# EAGLE board hashing.board (EAGLE 6.5.0)
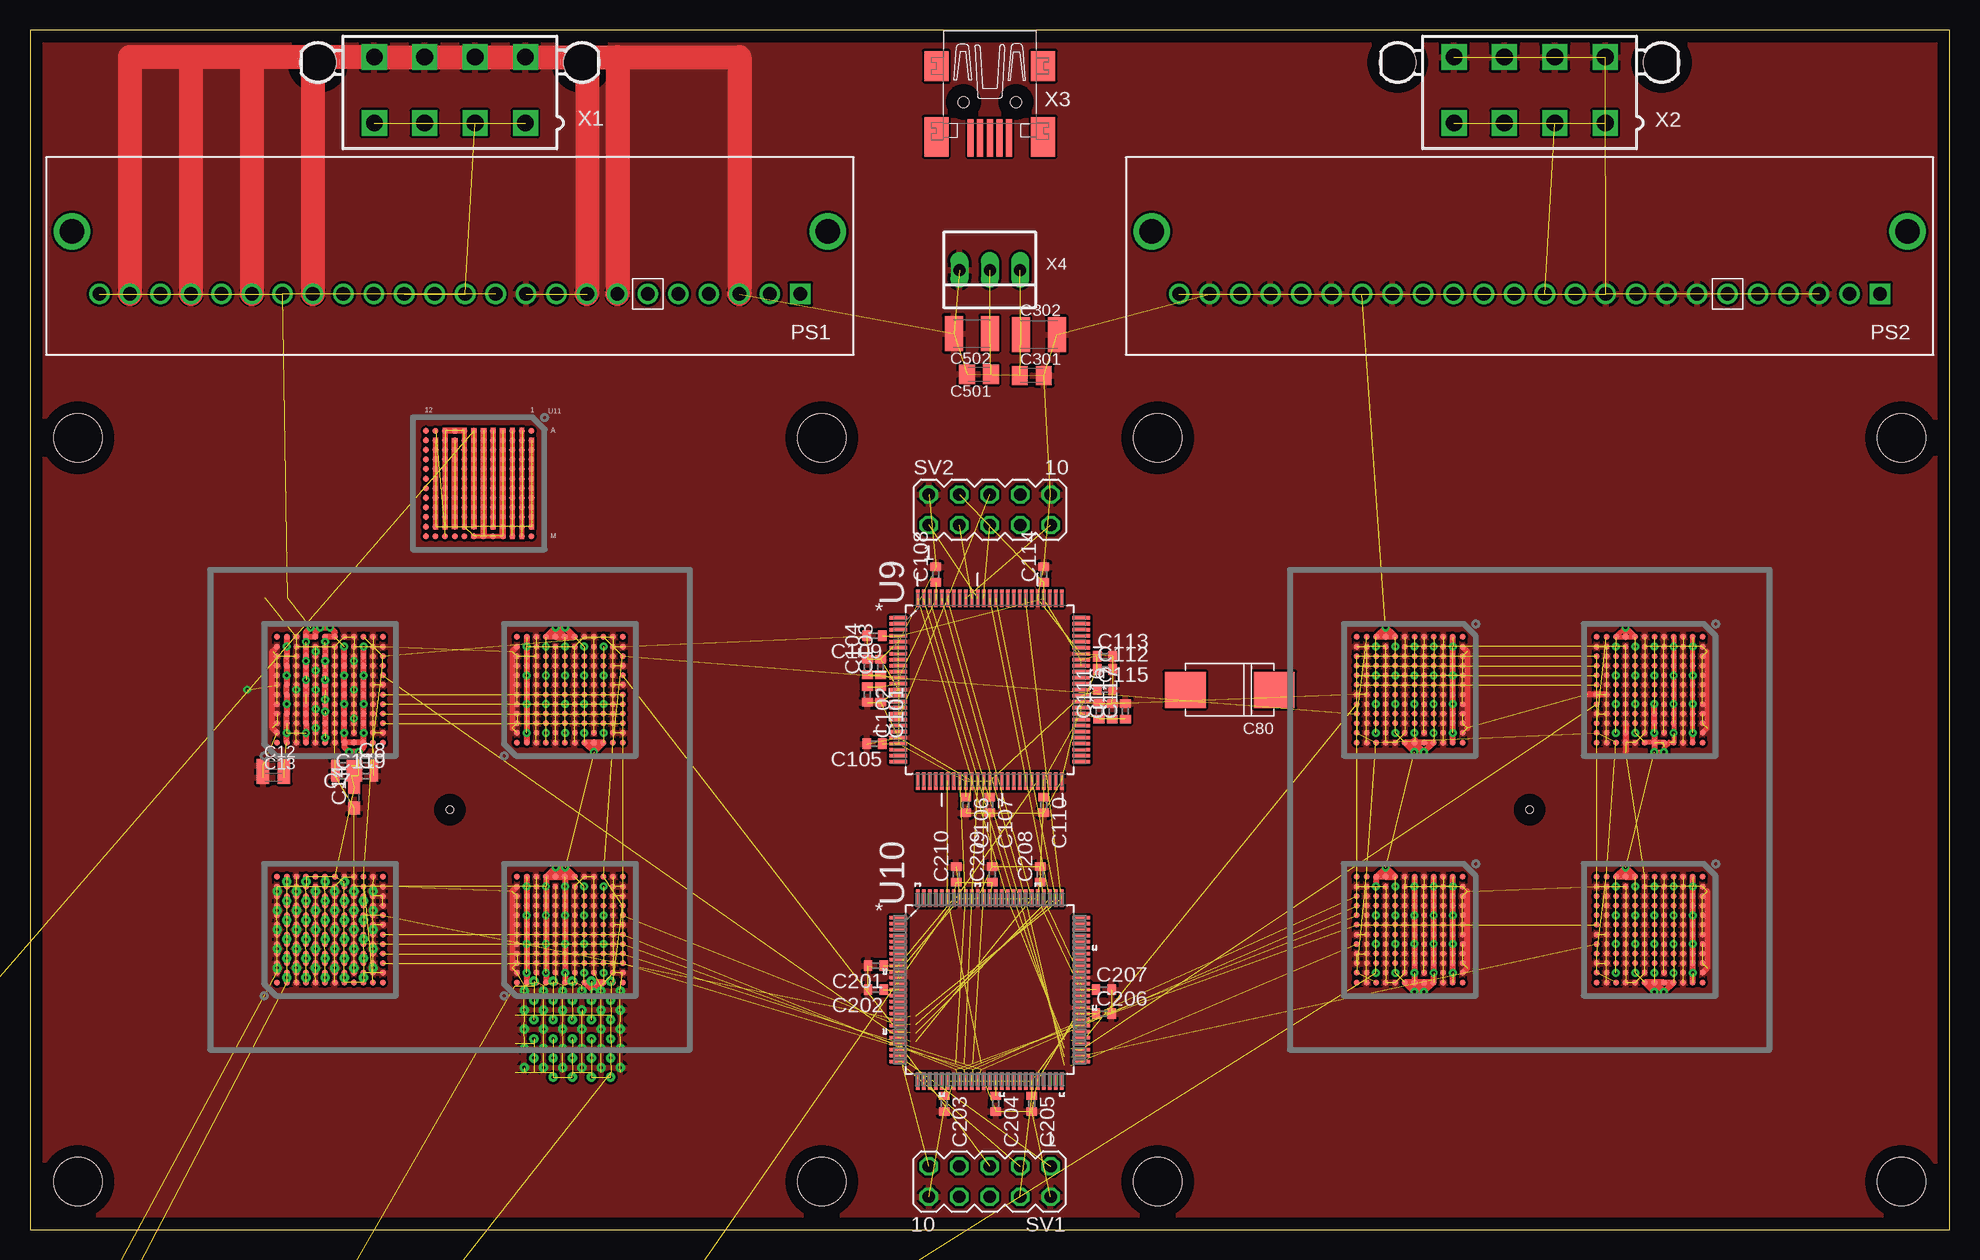
[diagram p4: board, top side]
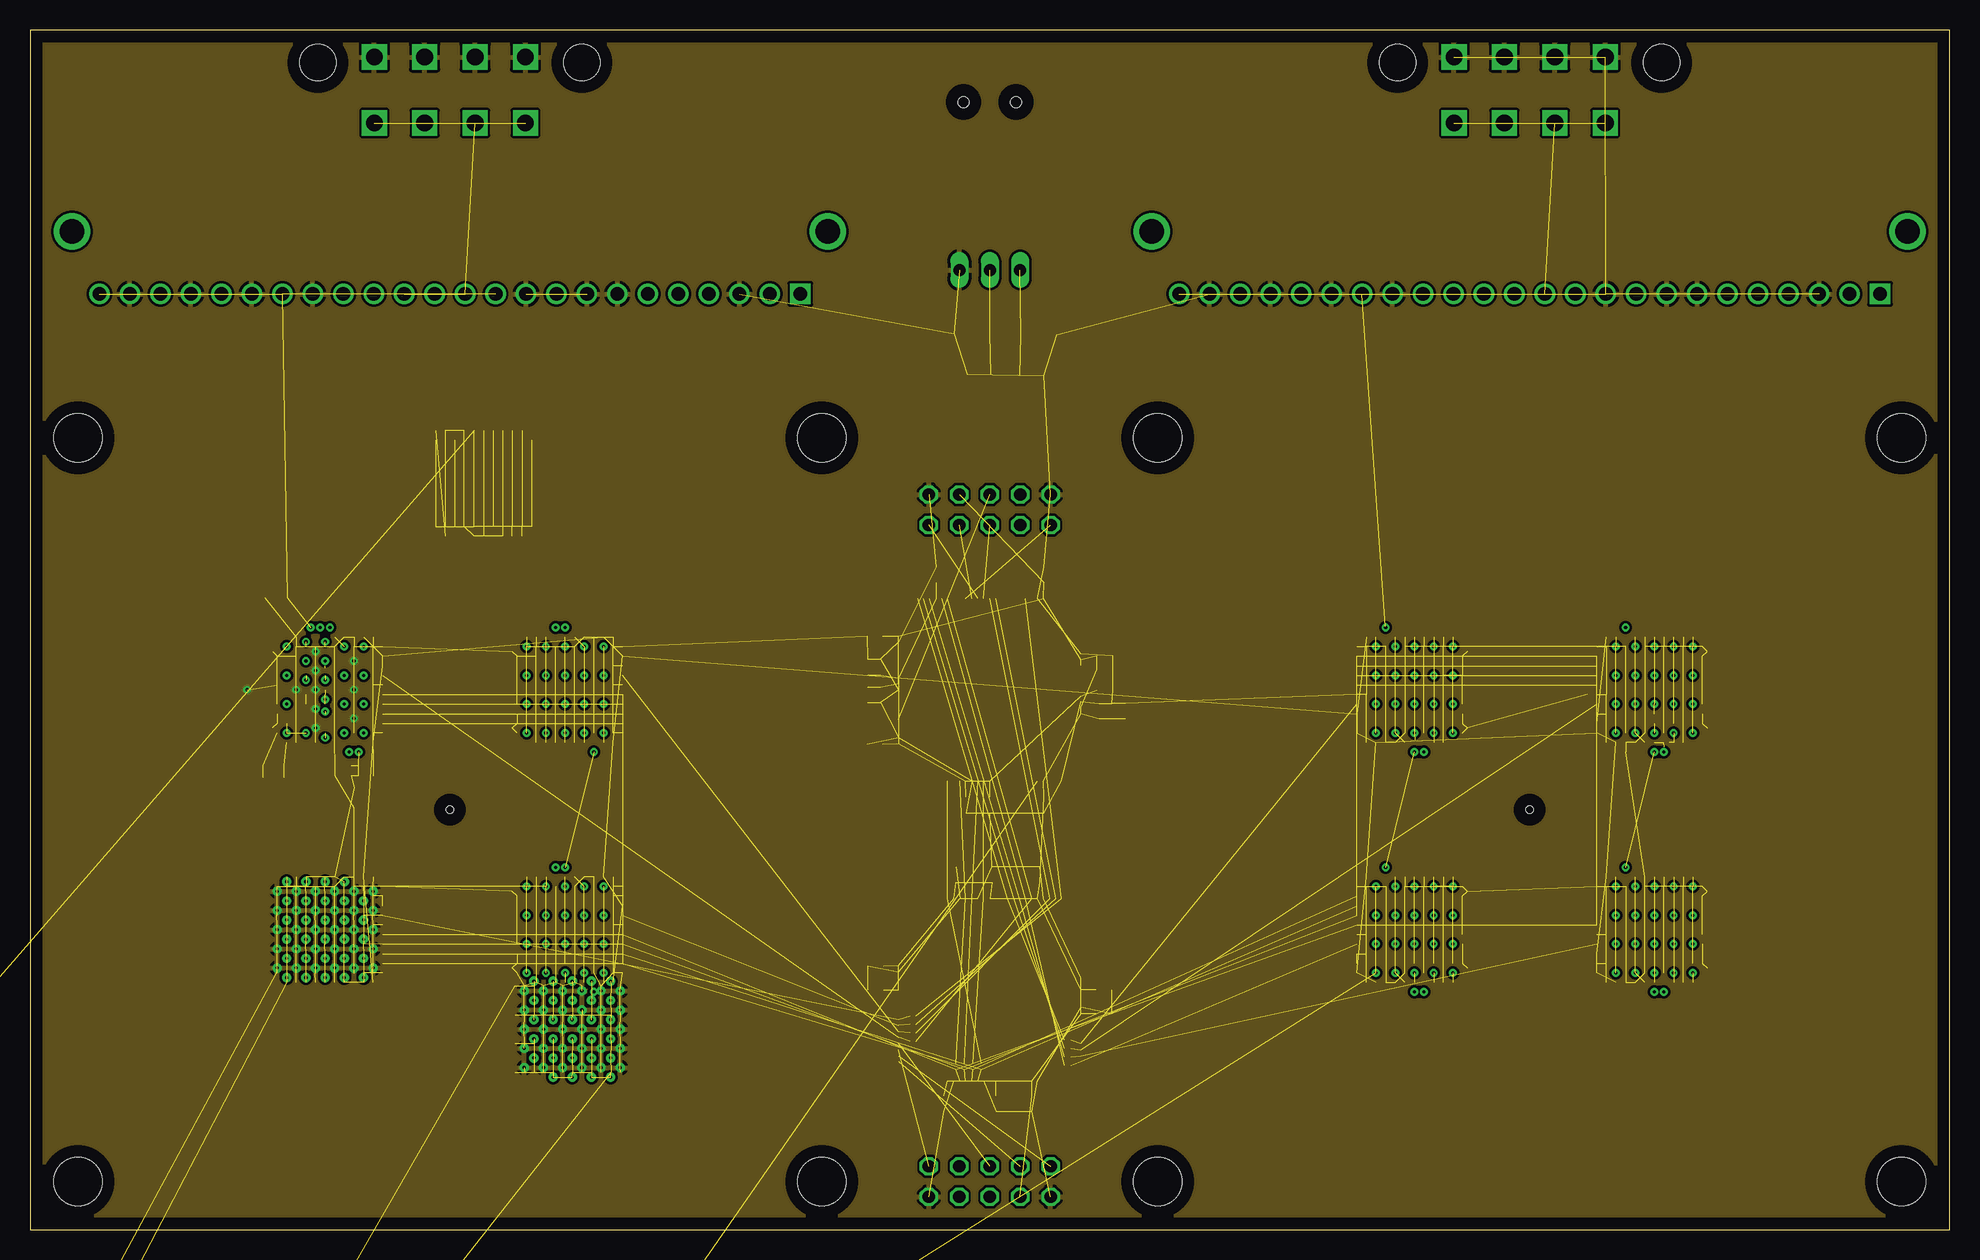
[diagram p5: board, inner layer $GND]
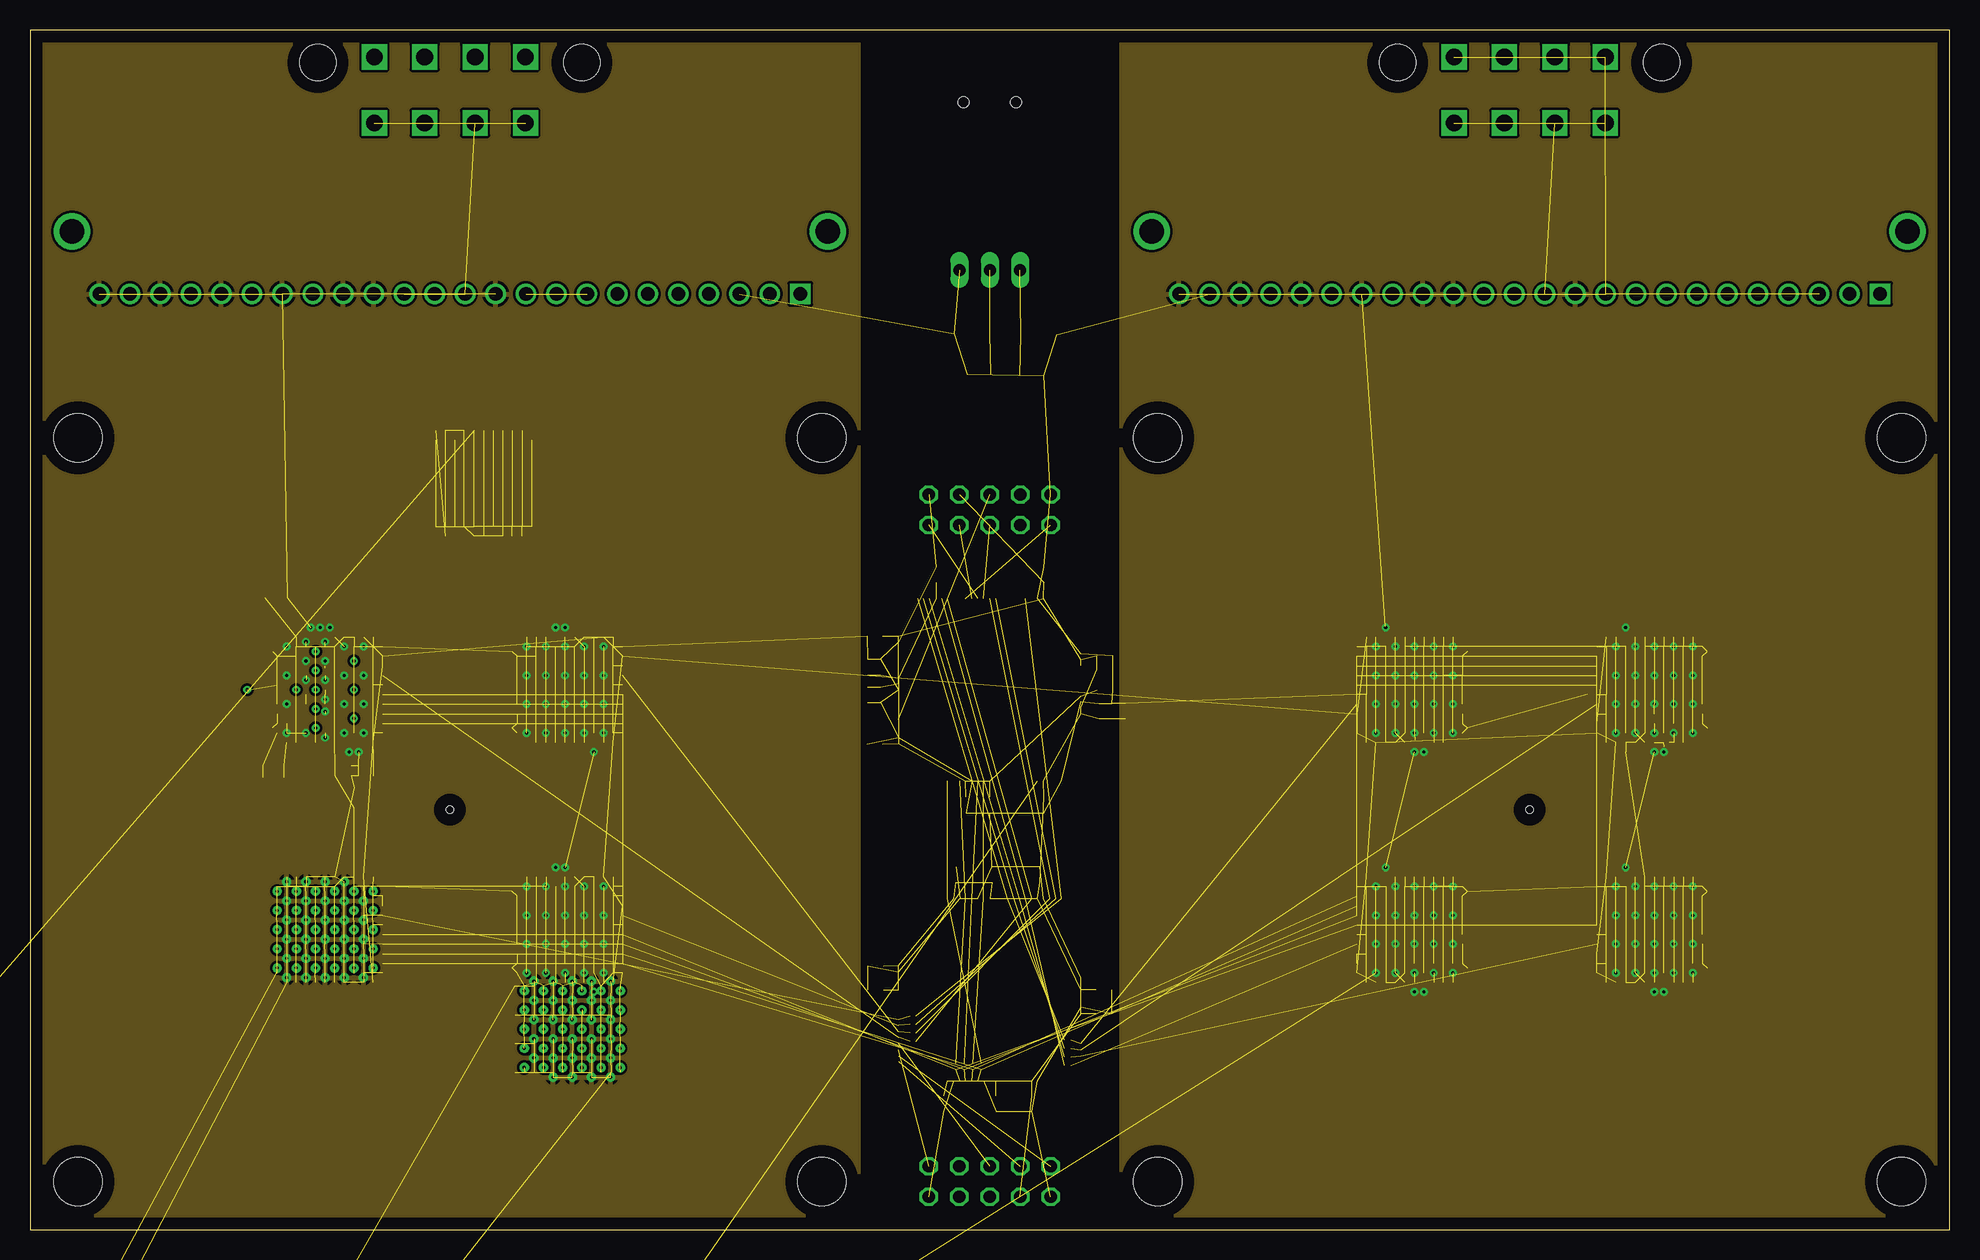
[diagram p6: board, inner layer $VCC]
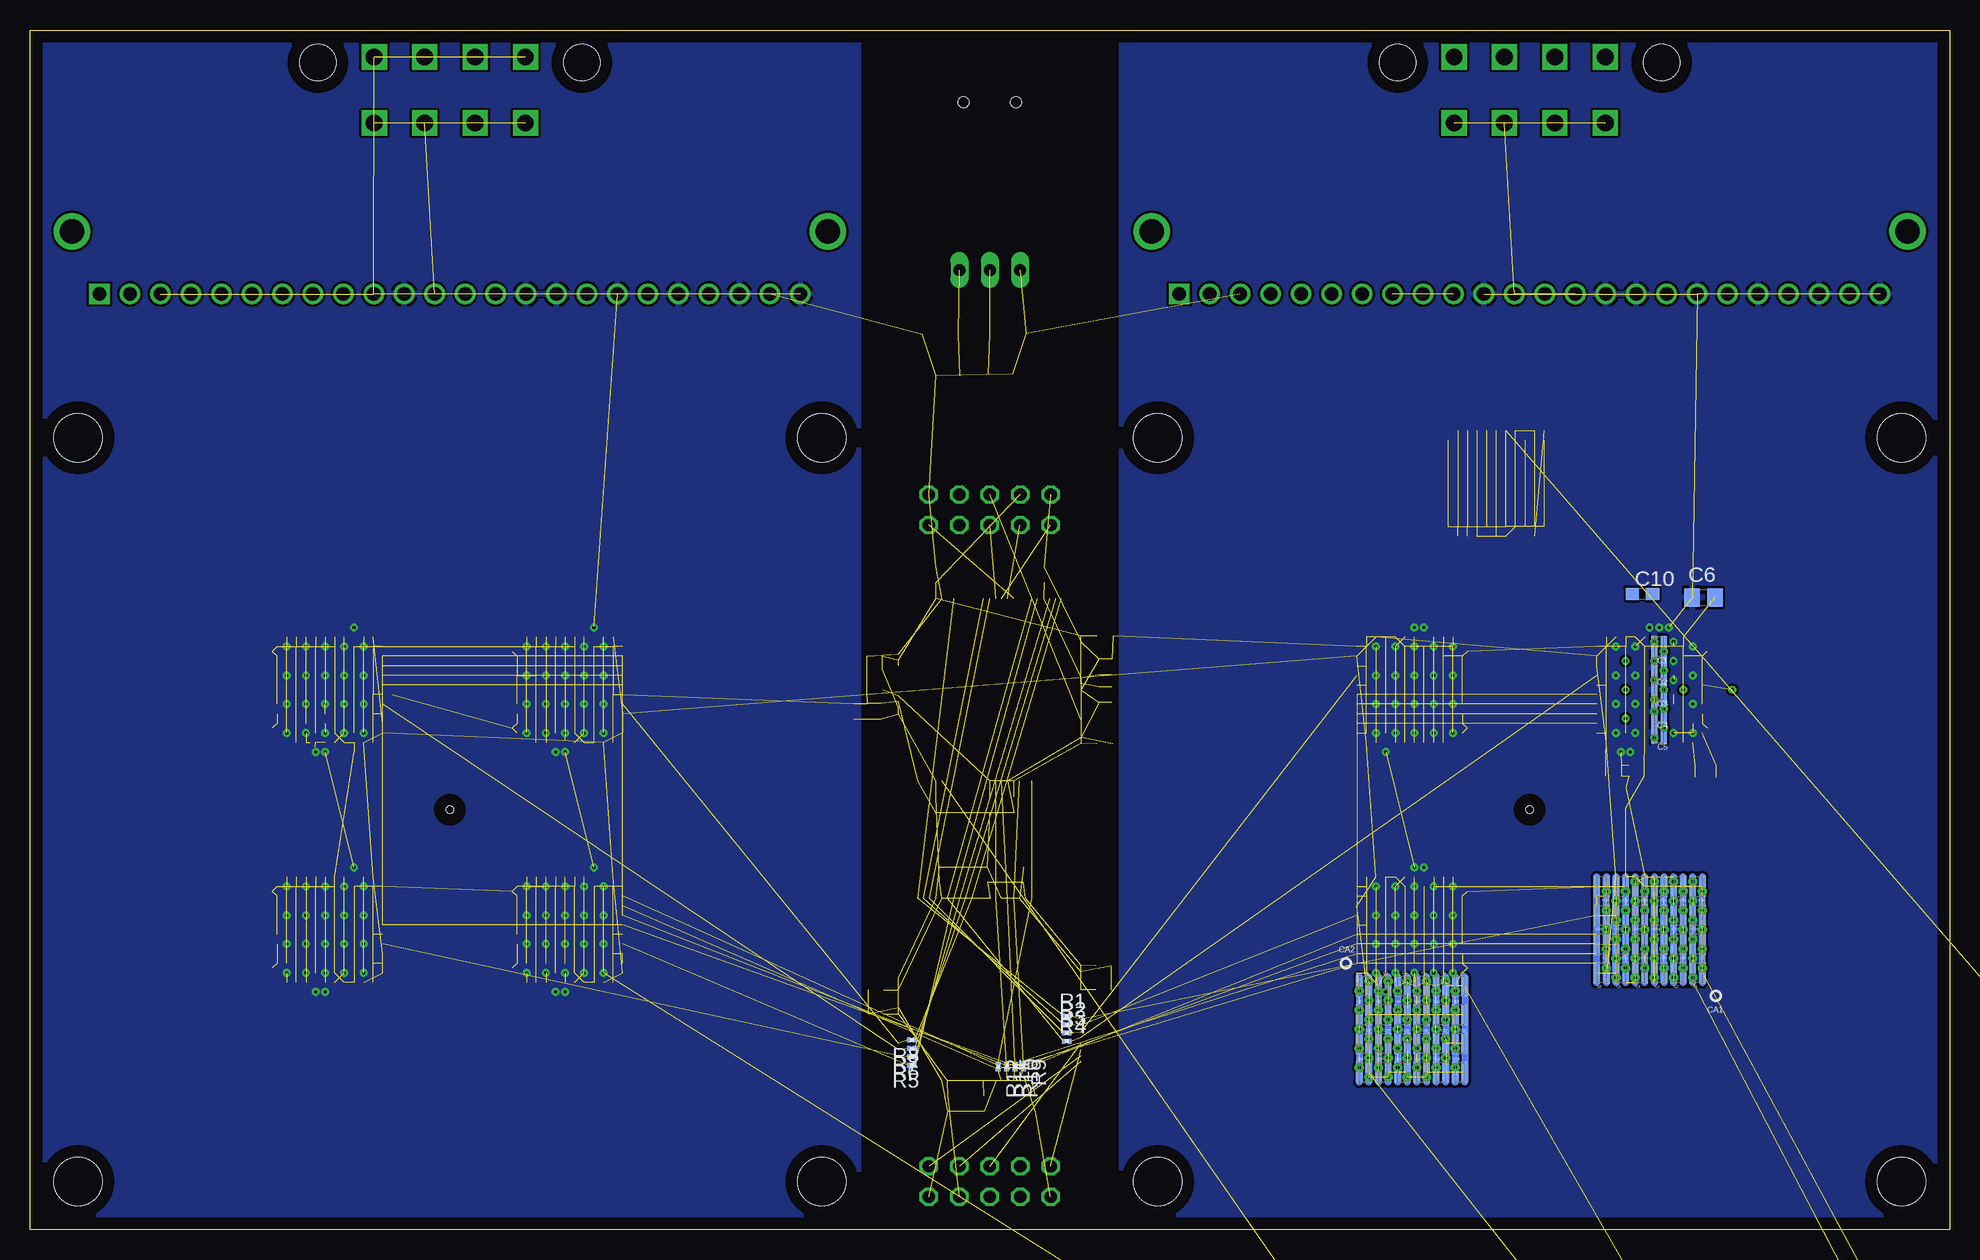
[diagram p7: board, bottom side, seen from below]

Size 160 x 100 mm. Coordinates in mm from the lower left corner, seen from the top.
Outline: 0,0 160,0 160,100 0,100 0,0
Copper layers (1*2*15*16): Top 0.075mm / dielectric 0.32mm / $GND 0.035mm / dielectric 0.32mm / $VCC 0.035mm / dielectric 0.32mm / Bottom 0.075mm
Design rules "default *": minimum track width 10mil, minimum drill 24mil, track to track 8mil, track to pad 8mil, pad to pad 8mil, via to via 8mil, smd to smd 8mil, copper to edge 40mil, drill to drill 8mil, minimum pad ring 10mil, minimum via ring 8mil, stop-mask expansion 4mil, vias tented up to drill 0mil, thermal gap 10mil
Holes 0.6 mm at 35,35 125,35
Holes 4 mm at 66,66 4,4 66,4 4,66 156,4 156,66 94,66 94,4

## Footprints (pad centres in the part's own frame; a part is rotated, then mirrored left to right if it is on the bottom)
0306-REV-GEO = smd 0.5 x 1.75: P$1 -0.4,0; P$2 0.4,0
C0805 = smd 1.3 x 1.5: 1 -0.95,0; 2 0.95,0
C0402 = smd 0.7 x 0.9: 1 -0.65,0; 2 0.65,0
C0603 = smd 1.1 x 1: 1 -0.85,0; 2 0.85,0
C0603K = smd 1.05 x 1.08: 1 -0.875,0; 2 0.875,0
2917(7343M) = smd 3.4 x 3: P$1 -3.7,0; P$2 3.7,0
C0805K = smd 1.3 x 1.6: 1 -1,0; 2 1,0
C1210K = smd 1.5 x 2.9: 1 -1.5,0; 2 1.5,0
BFL-BGA-VIA-PATTERN = drill 0.26 pad 0.6: N$2 0.4,-1.6; N$3 0.4,0; N$5 2,-1.6; N$6 2,0; N$8 -1.2,0; N$9 -1.2,-1.6; N$11 -2.8,0; N$12 -2.8,-1.6; N$14 -4.4,-1.6; N$15 -4.4,0; N$16 3.6,-1.6; N$17 3.6,0; N$19 0.4,-3.2; N$21 2,-3.2; N$23 -1.2,-3.2; N$25 -2.8,-3.2; N$27 -4.4,-3.2; N$28 3.6,-3.2; N$30 -1.2,3.2; N$31 -1.2,1.6; N$33 -2.8,3.2; N$34 -2.8,1.6; N$36 0.4,1.6; N$37 0.4,3.2; N$39 2,1.6; N$40 2,3.2; N$42 3.6,3.2; N$43 3.6,1.6; N$44 -4.4,3.2; N$45 -4.4,1.6; P$1 -0.4,-0.8; P$4 1.2,-0.8; P$7 2.8,-0.8; P$10 -2,-0.8; P$13 -3.6,-0.8; P$18 -0.4,-2.4; P$20 1.2,-2.4; P$22 2.8,-2.4; P$24 -2,-2.4; P$26 -3.6,-2.4; P$29 -0.4,2.4; P$32 -2,2.4; P$35 -3.6,2.4; P$38 1.2,2.4; P$41 2.8,2.4; P$46 -0.4,4; P$47 -0.4,-4; P$48 -2,4; P$49 1.2,-4; P$50 -3.6,4; P$51 -2,-4; P$52 1.2,4; P$53 -3.6,-4; P$54 2.8,4; P$57 -0.4,0.8; P$58 1.2,0.8; P$59 2.8,0.8; P$60 -2,0.8; P$61 -3.6,0.8 | smd 0.5 x 1.75: N$55 -4.42,1.21; N$62 -4.42,-1.19; N$64 -4.42,-3.59; N$66 -2.82,3.61; N$68 -2.82,1.21; N$70 -2.82,-1.19; N$72 -2.82,-3.59; N$74 -1.22,3.61; N$76 -1.22,1.21; N$78 -1.22,-1.19; N$80 -1.22,-3.59; N$82 0.38,3.61; N$84 0.38,1.21; N$86 0.38,-1.19; N$88 0.38,-3.59; N$90 1.98,3.61; N$92 1.98,1.21; N$94 1.98,-1.19; N$98 3.58,3.61; N$100 3.58,1.21; N$102 3.58,-1.19; N$104 1.98,-3.59; N$106 3.58,-3.59; N$110 -4.42,3.61; P$56 -3.62,1.21; P$63 -3.62,-1.19; P$65 -3.62,-3.59; P$67 -2.02,3.61; P$69 -2.02,1.21; P$71 -2.02,-1.19; P$73 -2.02,-3.59; P$75 -0.42,3.61; P$77 -0.42,1.21; P$79 -0.42,-1.19; P$81 -0.42,-3.59; P$83 1.18,3.61; P$85 1.18,1.21; P$87 1.18,-1.19; P$89 1.18,-3.59; P$91 2.78,3.61; P$93 2.78,1.21; P$95 2.78,-1.19; P$99 4.38,3.61; P$101 4.38,1.21; P$103 4.38,-1.19; P$105 2.78,-3.59; P$107 4.38,-3.59; P$111 -3.62,3.61
YV09T60 = drill 1.143 square: P$1 -29.21,0 | drill 1.143: P$2 -26.67,0; P$3 -24.13,0; P$4 -21.59,0; P$5 -19.05,0; P$6 -16.51,0; P$7 -13.97,0; P$8 -11.43,0; P$9 -8.89,0; P$10 -6.35,0; P$11 -3.81,0; P$12 -1.27,0; P$13 1.27,0; P$14 3.81,0; P$15 6.35,0; P$16 8.89,0; P$17 11.43,0; P$18 13.97,0; P$19 16.51,0; P$20 19.05,0; P$21 21.59,0; P$22 24.13,0; P$23 26.67,0; P$24 29.21,0 | drill 2.032: P$25 -31.496,-5.207; P$26 31.496,-5.207
R0201 = smd 0.28 x 0.43: 1 -0.255,0; 2 0.255,0
MA05-2 = drill 1.016 octagon: 1 -5.08,-1.27; 2 -5.08,1.27; 3 -2.54,-1.27; 4 -2.54,1.27; 5 0,-1.27; 6 0,1.27; 7 2.54,-1.27; 8 2.54,1.27; 9 5.08,-1.27; 10 5.08,1.27
BGA-144-0.8MM = smd 0.5 x 0.5: A1 4.4,4.4; A2 3.6,4.4; A3 2.8,4.4; A4 2,4.4; A5 1.2,4.4; A6 0.4,4.4; A7 -0.4,4.4; A8 -1.2,4.4; A9 -2,4.4; A10 -2.8,4.4; A11 -3.6,4.4; A12 -4.4,4.4; B1 4.4,3.6; B2 3.6,3.6; B3 2.8,3.6; B4 2,3.6; B5 1.2,3.6; B6 0.4,3.6; B7 -0.4,3.6; B8 -1.2,3.6; B9 -2,3.6; B10 -2.8,3.6; B11 -3.6,3.6; B12 -4.4,3.6; C1 4.4,2.8; C2 3.6,2.8; C3 2.8,2.8; C4 2,2.8; C5 1.2,2.8; C6 0.4,2.8; C7 -0.4,2.8; C8 -1.2,2.8; C9 -2,2.8; C10 -2.8,2.8; C11 -3.6,2.8; C12 -4.4,2.8; D1 4.4,2; D2 3.6,2; D3 2.8,2; D4 2,2; D5 1.2,2; D6 0.4,2; D7 -0.4,2; D8 -1.2,2; D9 -2,2; D10 -2.8,2; D11 -3.6,2; D12 -4.4,2; E1 4.4,1.2; E2 3.6,1.2; E3 2.8,1.2; E4 2,1.2; E5 1.2,1.2; E6 0.4,1.2; E7 -0.4,1.2; E8 -1.2,1.2; E9 -2,1.2; E10 -2.8,1.2; E11 -3.6,1.2; E12 -4.4,1.2; F1 4.4,0.4; F2 3.6,0.4; F3 2.8,0.4; F4 2,0.4; F5 1.2,0.4; F6 0.4,0.4; F7 -0.4,0.4; F8 -1.2,0.4; F9 -2,0.4; F10 -2.8,0.4; F11 -3.6,0.4; F12 -4.4,0.4; G1 4.4,-0.4; G2 3.6,-0.4; G3 2.8,-0.4; G4 2,-0.4; G5 1.2,-0.4; G6 0.4,-0.4; G7 -0.4,-0.4; G8 -1.2,-0.4; G9 -2,-0.4; G10 -2.8,-0.4; G11 -3.6,-0.4; G12 -4.4,-0.4; H1 4.4,-1.2; H2 3.6,-1.2; H3 2.8,-1.2; H4 2,-1.2; H5 1.2,-1.2; H6 0.4,-1.2; H7 -0.4,-1.2; H8 -1.2,-1.2; H9 -2,-1.2; H10 -2.8,-1.2; H11 -3.6,-1.2; H12 -4.4,-1.2; J1 4.4,-2; J2 3.6,-2; J3 2.8,-2; J4 2,-2; J5 1.2,-2; J6 0.4,-2; J7 -0.4,-2; J8 -1.2,-2; J9 -2,-2; J10 -2.8,-2; J11 -3.6,-2; J12 -4.4,-2; K1 4.4,-2.8; K2 3.6,-2.8; K3 2.8,-2.8; K4 2,-2.8; K5 1.2,-2.8; K6 0.4,-2.8; K7 -0.4,-2.8; K8 -1.2,-2.8; K9 -2,-2.8; K10 -2.8,-2.8; K11 -3.6,-2.8; K12 -4.4,-2.8; L1 4.4,-3.6; L2 3.6,-3.6; L3 2.8,-3.6; L4 2,-3.6; L5 1.2,-3.6; L6 0.4,-3.6; L7 -0.4,-3.6; L8 -1.2,-3.6; L9 -2,-3.6; L10 -2.8,-3.6; L11 -3.6,-3.6; L12 -4.4,-3.6; M1 4.4,-4.4; M2 3.6,-4.4; M3 2.8,-4.4; M4 2,-4.4; M5 1.2,-4.4; M6 0.4,-4.4; M7 -0.4,-4.4; M8 -1.2,-4.4; M9 -2,-4.4; M10 -2.8,-4.4; M11 -3.6,-4.4; M12 -4.4,-4.4
QFP50P1600X1600X120-100N = smd 1.473 x 0.279: 1 -7.62,5.994; 2 -7.62,5.512; 3 -7.62,5.004; 4 -7.62,4.496; 5 -7.62,3.988; 6 -7.62,3.505; 7 -7.62,2.997; 8 -7.62,2.489; 9 -7.62,2.007; 10 -7.62,1.499; 11 -7.62,0.991; 12 -7.62,0.508; 13 -7.62,0; 14 -7.62,-0.508; 15 -7.62,-0.991; 16 -7.62,-1.499; 17 -7.62,-2.007; 18 -7.62,-2.489; 19 -7.62,-2.997; 20 -7.62,-3.505; 21 -7.62,-3.988; 22 -7.62,-4.496; 23 -7.62,-5.004; 24 -7.62,-5.512; 25 -7.62,-5.994; 51 7.62,-5.994; 52 7.62,-5.512; 53 7.62,-5.004; 54 7.62,-4.496; 55 7.62,-3.988; 56 7.62,-3.505; 57 7.62,-2.997; 58 7.62,-2.489; 59 7.62,-2.007; 60 7.62,-1.499; 61 7.62,-0.991; 62 7.62,-0.508; 63 7.62,0; 64 7.62,0.508; 65 7.62,0.991; 66 7.62,1.499; 67 7.62,2.007; 68 7.62,2.489; 69 7.62,2.997; 70 7.62,3.505; 71 7.62,3.988; 72 7.62,4.496; 73 7.62,5.004; 74 7.62,5.512; 75 7.62,5.994 | smd 0.279 x 1.473: 26 -5.994,-7.62; 27 -5.512,-7.62; 28 -5.004,-7.62; 29 -4.496,-7.62; 30 -3.988,-7.62; 31 -3.505,-7.62; 32 -2.997,-7.62; 33 -2.489,-7.62; 34 -2.007,-7.62; 35 -1.499,-7.62; 36 -0.991,-7.62; 37 -0.508,-7.62; 38 0,-7.62; 39 0.508,-7.62; 40 0.991,-7.62; 41 1.499,-7.62; 42 2.007,-7.62; 43 2.489,-7.62; 44 2.997,-7.62; 45 3.505,-7.62; 46 3.988,-7.62; 47 4.496,-7.62; 48 5.004,-7.62; 49 5.512,-7.62; 50 5.994,-7.62; 76 5.994,7.62; 77 5.512,7.62; 78 5.004,7.62; 79 4.496,7.62; 80 3.988,7.62; 81 3.505,7.62; 82 2.997,7.62; 83 2.489,7.62; 84 2.007,7.62; 85 1.499,7.62; 86 0.991,7.62; 87 0.508,7.62; 88 0,7.62; 89 -0.508,7.62; 90 -0.991,7.62; 91 -1.499,7.62; 92 -2.007,7.62; 93 -2.489,7.62; 94 -2.997,7.62; 95 -3.505,7.62; 96 -3.988,7.62; 97 -4.496,7.62; 98 -5.004,7.62; 99 -5.512,7.62; 100 -5.994,7.62
BFL-BGA-BIG-PADS = smd 0.5 x 0.5: A1 4.4,4.4; A2 3.6,4.4; A3 2.8,4.4; A4 2,4.4; A5 1.2,4.4; A6 0.4,4.4; A7 -0.4,4.4; A8 -1.2,4.4; A9 -2,4.4; A10 -2.8,4.4; A11 -3.6,4.4; A12 -4.4,4.4; B1 4.4,3.6; B2 3.6,3.6; B3 2.8,3.6; B4 2,3.6; B5 1.2,3.6; B6 0.4,3.6; B7 -0.4,3.6; B8 -1.2,3.6; B9 -2,3.6; B10 -2.8,3.6; B11 -3.6,3.6; B12 -4.4,3.6; C1 4.4,2.8; C2 3.6,2.8; C3 2.8,2.8; C4 2,2.8; C5 1.2,2.8; C6 0.4,2.8; C7 -0.4,2.8; C8 -1.2,2.8; C9 -2,2.8; C10 -2.8,2.8; C11 -3.6,2.8; C12 -4.4,2.8; D1 4.4,2; D2 3.6,2; D3 2.8,2; D4 2,2; D5 1.2,2; D6 0.4,2; D7 -0.4,2; D8 -1.2,2; D9 -2,2; D10 -2.8,2; D11 -3.6,2; D12 -4.4,2; E1 4.4,1.2; E2 3.6,1.2; E3 2.8,1.2; E4 2,1.2; E5 1.2,1.2; E6 0.4,1.2; E7 -0.4,1.2; E8 -1.2,1.2; E9 -2,1.2; E10 -2.8,1.2; E11 -3.6,1.2; E12 -4.4,1.2; F1 4.4,0.4; F2 3.6,0.4; F3 2.8,0.4; F4 2,0.4; F5 1.2,0.4; F6 0.4,0.4; F7 -0.4,0.4; F8 -1.2,0.4; F9 -2,0.4; F10 -2.8,0.4; F11 -3.6,0.4; F12 -4.4,0.4; G1 4.4,-0.4; G2 3.6,-0.4; G3 2.8,-0.4; G4 2,-0.4; G5 1.2,-0.4; G6 0.4,-0.4; G7 -0.4,-0.4; G8 -1.2,-0.4; G9 -2,-0.4; G10 -2.8,-0.4; G11 -3.6,-0.4; G12 -4.4,-0.4; H1 4.4,-1.2; H2 3.6,-1.2; H3 2.8,-1.2; H4 2,-1.2; H5 1.2,-1.2; H6 0.4,-1.2; H7 -0.4,-1.2; H8 -1.2,-1.2; H9 -2,-1.2; H10 -2.8,-1.2; H11 -3.6,-1.2; H12 -4.4,-1.2; J1 4.4,-2; J2 3.6,-2; J3 2.8,-2; J4 2,-2; J5 1.2,-2; J6 0.4,-2; J7 -0.4,-2; J8 -1.2,-2; J9 -2,-2; J10 -2.8,-2; J11 -3.6,-2; J12 -4.4,-2; K1 4.4,-2.8; K2 3.6,-2.8; K3 2.8,-2.8; K4 2,-2.8; K5 1.2,-2.8; K6 0.4,-2.8; K7 -0.4,-2.8; K8 -1.2,-2.8; K9 -2,-2.8; K10 -2.8,-2.8; K11 -3.6,-2.8; K12 -4.4,-2.8; L1 4.4,-3.6; L2 3.6,-3.6; L3 2.8,-3.6; L4 2,-3.6; L5 1.2,-3.6; L6 0.4,-3.6; L7 -0.4,-3.6; L8 -1.2,-3.6; L9 -2,-3.6; L10 -2.8,-3.6; L11 -3.6,-3.6; L12 -4.4,-3.6; M1 4.4,-4.4; M2 3.6,-4.4; M3 2.8,-4.4; M4 2,-4.4; M5 1.2,-4.4; M6 0.4,-4.4; M7 -0.4,-4.4; M8 -1.2,-4.4; M9 -2,-4.4; M10 -2.8,-4.4; M11 -3.6,-4.4; M12 -4.4,-4.4
R0402 = smd 0.7 x 0.9: 1 -0.65,0; 2 0.65,0
5566-8 = drill 1.4 square: 1 6.3,-2.75; 2 2.1,-2.75; 3 -2.1,-2.75; 4 -6.3,-2.75; 5 6.3,2.75; 6 2.1,2.75; 7 -2.1,2.75; 8 -6.3,2.75 | hole 3: 11,2.29; -11,2.29
32005-301 = smd 3.1 x 0.5: 1 3,1.6; 2 3,0.8; 3 3,0; 4 3,-0.8; 5 3,-1.6 | smd 2.5 x 2: M1 -3,-4.45; M2 -3,4.45 | smd 3.3 x 2: M3 2.9,4.45; M4 2.9,-4.45 | hole 0.9: 0,2.2; 0,-2.2
22-23-2031 = drill 1 long: 1 -2.54,0; 2 0,0; 3 2.54,0

## Placement (x,y rotation side)
C1  [0306-REV-GEO]  24.2,48.6 180 bottom
C2  [0306-REV-GEO]  24.2,46.8 180 bottom
C3  [0306-REV-GEO]  24.2,45 180 bottom
C4  [0306-REV-GEO]  24.2,43.2 180 bottom
C5  [0306-REV-GEO]  24.2,41.4 180 bottom
C6  [C0805]  20.5,52.7 0 bottom
C7  [C0402]  26.1,38.7 180 top
C8  [C0402]  28,38.7 0 top
C9  [C0402]  28,37.8 0 top
C10  [C0603]  25.6,53 0 bottom
C11  [C0402]  26.1,37.8 0 top
C12  [C0603K]  20.3,38.7 0 top
C13  [C0603K]  20.3,37.7 0 top
C14  [C0603]  27,36 90 top
C15  [C0603K]  5.4,-8.3 0 top  (outside the outline)
C16  [C0603K]  1.6,-11.4 0 top  (outside the outline)
C17  [C0603K]  5.4,-11.4 0 top  (outside the outline)
C18  [C0603K]  1.6,-14.5 0 top  (outside the outline)
C19  [C0603K]  5.4,-14.5 0 top  (outside the outline)
C21  [C0603K]  1.6,-20.7 0 top  (outside the outline)
C22  [C0603K]  5.4,-20.7 0 top  (outside the outline)
C23  [C0603K]  1.6,-23.8 0 top  (outside the outline)
C24  [C0603K]  5.4,-23.8 0 top  (outside the outline)
C25  [C0603K]  1.6,-26.9 0 top  (outside the outline)
C26  [C0603K]  5.4,-26.9 0 top  (outside the outline)
C27  [C0603K]  1.6,-30 0 top  (outside the outline)
C28  [C0603K]  5.4,-30 0 top  (outside the outline)
C29  [C0603K]  1.6,-33.1 0 top  (outside the outline)
C31  [C0603K]  1.6,-36.2 0 top  (outside the outline)
C32  [C0603K]  5.4,-36.2 0 top  (outside the outline)
C33  [C0603K]  1.6,-39.3 0 top  (outside the outline)
C34  [C0603K]  5.4,-39.3 0 top  (outside the outline)
C35  [C0603K]  1.6,-42.4 0 top  (outside the outline)
C36  [C0603K]  5.4,-42.4 0 top  (outside the outline)
C37  [C0603K]  1.6,-45.5 0 top  (outside the outline)
C38  [C0603K]  5.4,-45.5 0 top  (outside the outline)
C39  [C0603K]  1.6,-48.6 0 top  (outside the outline)
C41  [C0603K]  1.6,-51.7 0 top  (outside the outline)
C42  [C0603K]  5.4,-51.7 0 top  (outside the outline)
C43  [C0603K]  9.2,-51.7 0 top  (outside the outline)
C44  [C0603K]  13,-51.7 0 top  (outside the outline)
C45  [C0603K]  16.8,-51.7 0 top  (outside the outline)
C46  [C0603K]  1.6,-54.8 0 top  (outside the outline)
C47  [C0603K]  5.4,-54.8 0 top  (outside the outline)
C48  [C0603K]  9.2,-54.8 0 top  (outside the outline)
C49  [C0603K]  13,-54.8 0 top  (outside the outline)
C51  [C0603K]  1.6,-57.9 0 top  (outside the outline)
C52  [C0603K]  5.4,-57.9 0 top  (outside the outline)
C53  [C0603K]  9.2,-57.9 0 top  (outside the outline)
C54  [C0603K]  13,-57.9 0 top  (outside the outline)
C55  [C0603K]  16.8,-57.9 0 top  (outside the outline)
C56  [C0603K]  1.6,-61 0 top  (outside the outline)
C57  [C0603K]  5.4,-61 0 top  (outside the outline)
C58  [C0603K]  9.2,-61 0 top  (outside the outline)
C59  [C0603K]  13,-61 0 top  (outside the outline)
C61  [C0603K]  1.6,-64.1 0 top  (outside the outline)
C62  [C0603K]  5.4,-64.1 0 top  (outside the outline)
C63  [C0603K]  9.2,-64.1 0 top  (outside the outline)
C64  [C0603K]  13,-64.1 0 top  (outside the outline)
C65  [C0603K]  16.8,-64.1 0 top  (outside the outline)
C66  [C0603K]  1.6,-67.2 0 top  (outside the outline)
C67  [C0603K]  5.4,-67.2 0 top  (outside the outline)
C68  [C0603K]  9.2,-67.2 0 top  (outside the outline)
C69  [C0603K]  13,-67.2 0 top  (outside the outline)
C71  [C0603K]  1.6,-70.3 0 top  (outside the outline)
C72  [C0603K]  5.4,-70.3 0 top  (outside the outline)
C73  [C0603K]  9.2,-70.3 0 top  (outside the outline)
C74  [C0603K]  13,-70.3 0 top  (outside the outline)
C75  [C0603K]  16.8,-70.3 0 top  (outside the outline)
C76  [C0603K]  1.6,-73.4 0 top  (outside the outline)
C77  [C0603K]  5.4,-73.4 0 top  (outside the outline)
C78  [C0603K]  9.2,-73.4 0 top  (outside the outline)
C79  [C0603K]  13,-73.4 0 top  (outside the outline)
C80  [2917(7343M)]  100,45 180 top
C101  [C0402]  70.9,44.6 270 top
C102  [C0402]  69.8,44.6 270 top
C103  [C0402]  70.9,46.9 90 top
C104  [C0402]  69.8,46.9 90 top
C105  [C0402]  70.4,40.5 180 top
C106  [C0402]  78,35.4 270 top
C107  [C0402]  80,35.4 270 top
C108  [C0402]  75.5,54.6 90 top
C109  [C0402]  70.4,49.5 180 top
C110  [C0402]  84.5,35.4 270 top
C111  [C0402]  89.1,43.2 90 top
C112  [C0402]  89.6,46.7 0 top
C113  [C0402]  89.6,47.8 0 top
C114  [C0402]  84.5,54.6 90 top
C115  [C0402]  89.6,45 0 top
C116  [C0402]  90.2,43.2 90 top
C117  [C0402]  91.3,43.2 90 top
C201  [C0402]  70.5,22 180 top
C202  [C0402]  70.5,20 180 top
C203  [C0402]  76.2,10.5 270 top
C204  [C0402]  80.5,10.5 270 top
C205  [C0402]  83.5,10.5 270 top
C206  [C0402]  89.5,18 0 top
C207  [C0402]  89.5,20 0 top
C208  [C0402]  84.2,29.6 90 top
C209  [C0402]  80.2,29.6 90 top
C210  [C0402]  77.2,29.6 90 top
C301  [C0805K]  83.5,71.2 0 top
C302  [C1210K]  84.1,74.6 0 top
C501  [C0805K]  79.1,71.3 180 top
C502  [C1210K]  78.5,74.7 180 top
CA1  BFL-BGA-144-SPC  [BFL-BGA-VIA-PATTERN]  25,25 180 bottom
CA2  BFL-BGA-144-SPC  [BFL-BGA-VIA-PATTERN]  44.8,16.7 0 bottom
CA3  BFL-BGA-144-SPC  [BFL-BGA-VIA-PATTERN]  -40.6,-90.8 0 top  (outside the outline)
CA4  BFL-BGA-144-SPC  [BFL-BGA-VIA-PATTERN]  -52.8,-90.8 0 top  (outside the outline)
CA5  BFL-BGA-144-SPC  [BFL-BGA-VIA-PATTERN]  -65,-90.8 0 top  (outside the outline)
CA6  BFL-BGA-144-SPC  [BFL-BGA-VIA-PATTERN]  -77.2,-90.8 0 top  (outside the outline)
CA7  BFL-BGA-144-SPC  [BFL-BGA-VIA-PATTERN]  -89.4,-90.8 0 top  (outside the outline)
CA8  BFL-BGA-144-SPC  [BFL-BGA-VIA-PATTERN]  -101.6,-90.8 0 top  (outside the outline)
PS1  YV09T60  [YV09T60]  35,78 180 top
PS2  YV09T60  [YV09T60]  125,78 180 top
R1  [R0201]  73.6,17.8 0 bottom
R2  [R0201]  73.6,17.1 0 bottom
R3  [R0201]  73.6,16.4 0 bottom
R4  [R0201]  73.6,15.7 0 bottom
R5  [R0201]  86.5,13.7 180 bottom
R6  [R0201]  86.5,14.4 180 bottom
R7  [R0201]  86.5,15.1 180 bottom
R8  [R0201]  86.5,15.8 180 bottom
R9  [R0201]  77.2,13.6 270 bottom
R10  [R0201]  77.9,13.6 270 bottom
R11  [R0201]  78.6,13.6 270 bottom
R12  [R0201]  79.3,13.6 270 bottom
SV1  [MA05-2]  80,4 180 top
SV2  [MA05-2]  80,60 0 top
U1  ASIC-1  [BGA-144-0.8MM]  25,25 180 top
U2  ASIC-1  [BGA-144-0.8MM]  45,25 180 top
U3  ASIC-1  [BGA-144-0.8MM]  45,45 180 top
U4  ASIC-1  [BGA-144-0.8MM]  25,45 180 top
U5  ASIC-1  [BGA-144-0.8MM]  115,25 0 top
U6  ASIC-1  [BGA-144-0.8MM]  135,25 0 top
U7  ASIC-1  [BGA-144-0.8MM]  135,45 0 top
U8  ASIC-1  [BGA-144-0.8MM]  115,45 0 top
U9  AT32UC3A1256-AUT  [QFP50P1600X1600X120-100N]  80,45 0 top
U10  EPM570GT100C5N  [QFP50P1600X1600X120-100N]  80,20 0 top
U11  BFL-ASIC-1  [BFL-BGA-BIG-PADS]  37.4,62.2 0 top
WHAT_VOLTAGE  [R0402]  -9.1,-95.6 0 top  (outside the outline)
X1  5566-8  [5566-8]  35,95 0 top
X2  5566-8  [5566-8]  125,95 0 top
X3  MINI-USB-32005-301  [32005-301]  80,94 270 top
X4  22-23-2031  [22-23-2031]  80,80 180 top

## Tracks (layer width: path | path; a pad name or v marks a point on that pad's centre or on a via)
ATMEL_RST  (1 unrouted)
ATMEL_TCK  (1 unrouted)
ATMEL_TDI  (1 unrouted)
ATMEL_TDO  (1 unrouted)
ATMEL_TMS  (1 unrouted)
CHECK_VOLTAGE  (1 unrouted)
CPLD_TCK  (1 unrouted)
CPLD_TDI  (1 unrouted)
CPLD_TDO  (1 unrouted)
CPLD_TMS  (1 unrouted)
DONE0  (2 unrouted)
DONE1  (2 unrouted)
DONE2  (2 unrouted)
DONE3  (2 unrouted)
DONE4  (2 unrouted)
DONE5  (2 unrouted)
DONE6  (2 unrouted)
DONE7  (2 unrouted)
DONE_0  (2 unrouted)
DONE_1  (2 unrouted)
DONE_2  (2 unrouted)
DONE_3  (2 unrouted)
DONE_4  (2 unrouted)
DONE_5  (2 unrouted)
DONE_6  (2 unrouted)
DONE_7  (2 unrouted)
GND  (via drill 0.26 pad 0.5)  (1203 unrouted)
  Top 0.406: U7.L1 139.8,41.8 139.8,48.2
  Top 0.5: U7.K9 133,39.8 | U7.G11 129.8,44.6 | U4.B1 20.2,41.8 20.2,48.2 20.25,48.2 U4.L1 | U3.L1 40.2,48.2 40.2,41.8 | U2.L1 40.2,28.2 40.2,21.8 | U8.B1 119.8,48.2 119.8,41.8 | 139.8,28.2 139.8,21.8 U6.L1 | U5.L1 119.8,21.8 119.8,28.2
  Top 2: X1.5 46.43,97.75 PS1.P$8 | X1.8 23.57,97.75 PS1.P$17 | X1.8 18.49,97.75 PS1.P$19 | X1.5 48.97,97.75 PS1.P$7 | X1.5 59.13,97.75 PS1.P$3 | X1.8 13.41,97.75 PS1.P$21 | X1.8 8.33,97.75 PS1.P$23 | X1.8 X1.7 X1.6 X1.5
  other vias: 27,42.6 27,45 23.8,48.2 22.2,45 18.1,45 27,47.4 23.8,46.6 23.8,45 23.8,43.4 23.8,41.8
  pour Top: 1,1 159,1 159,99 1,99
  pour $GND: 1,99 159,99 159,1 1,1
N$14  (8 unrouted)
N$17  (8 unrouted)
N$20  (8 unrouted)
N$23  (8 unrouted)
N$24  (3 unrouted)
SPI_1_CLK  (9 unrouted)
SPI_1_CLK_  (2 unrouted)
SPI_1_CS  (9 unrouted)
SPI_1_CS_  (2 unrouted)
SPI_1_MISO  (9 unrouted)
SPI_1_MISO_  (2 unrouted)
SPI_1_MOSI  (9 unrouted)
SPI_1_MOSI_  (2 unrouted)
VCC+1V8  (12 unrouted)
VCC+3V3  (39 unrouted)
VDD  (60 unrouted)
VDD3.3  (27 unrouted)
VDD-1VA  (via drill 0.26 pad 0.5)  (435 unrouted)
  Top 0.5: U4.M4 U4.M5 23.8,49.8 v24.2,50.2 v25,50.2 25.4,49.8 U4.M7 U4.M6 v24.6,49 U4.K6 U4.J6 v24.6,47.4 U4.G6 U4.F6 v24.6,45.8 U4.D6 U4.C6 v24.6,41 U4.A6 | U4.A2 U4.C2 U4.D2 U4.E2 U4.F2 U4.G2 U4.H2 U4.J2 U4.K2 U4.L2 U4.M2 | U4.L10 U4.K10 U4.J10 U4.H10 U4.G10 U4.F10 U4.E10 U4.D10 U4.C10 U4.B10 U4.A10 | U3.M2 U3.A2 | U3.M5 U3.M6 | U3.M6 U3.M7 v44.6,50.2 v43.8,50.2 | U3.M5 U3.M4 v43.8,50.2 | U3.M5 v43.8,50.2 | v43.8,50.2 U3.M6 | U3.A9 v47,39.8 | v47,39.8 U3.A10 U3.A8 v47,39.8 | U2.M2 U2.A2 | U2.M4 U2.A4 | U2.M4 U2.M5 | U2.M6 U2.M7 v44.6,30.2 | v43.8,30.2 U2.M4 | U2.M6 v44.6,30.2 | U2.M6 v43.8,30.2 | v43.8,30.2 U2.M5 | U2.M5 U2.M6 | U2.A9 U2.A8 v47,19.8 | U2.A9 v47,19.8 | v47,19.8 U2.A10 U2.A9 | v44.6,30.2 U2.A6 | v43.8,30.2 v44.6,30.2 | U4.A8 26.2,40.2 v26.6,39.8 v27.4,39.8 27.8,40.2 U4.A10 | U4.A10 U4.A9 U4.A8 | U4.A8 U4.B8 U4.C8 U4.D8 U4.E8 U4.F8 U4.G8 U4.H8 U4.J8 U4.K8 U4.L8 | U4.A4 U4.B4 U4.C4 U4.D4 v23,45.8 | v23,45.8 U4.F4 U4.G4 v23,45.8 | v23,45.8 U4.J4 v23,47.4 U4.K4 v23,49 U4.M4 | U4.M4 23,49.8 v23.4,50.2
  other vias: 23,41.4 21.4,41.4 26.2,41.4 27.8,41.4 26.2,43.8 26.2,46.2 26.2,48.6 27.8,48.6 27.8,46.2 27.8,43.8 21.4,43.8 21.4,46.2 21.4,48.6 44.6,41.4 43,41.4 41.4,41.4 46.2,41.4 47.8,41.4 46.2,43.8 47.8,43.8 44.6,43.8 43,43.8 41.4,43.8 46.2,46.2 46.2,48.6 47.8,48.6 47.8,46.2 41.4,46.2 43,46.2 44.6,46.2 44.6,48.6 43,48.6 41.4,48.6 44.6,21.4 43,21.4 41.4,21.4 46.2,21.4 47.8,21.4 46.2,23.8 47.8,23.8 44.6,23.8 43,23.8 41.4,23.8 46.2,26.2 46.2,28.6 47.8,28.6 47.8,26.2 41.4,26.2 43,26.2 44.6,26.2 44.6,28.6 43,28.6 41.4,28.6 24.6,44.2 24.6,43.2
  pour $VCC: 1,99 69,99 69,1 1,1
  pour Bottom: 1,1 69,1 69,99 1,99
VDD-1VB  (via drill 0.26 pad 0.5)  (435 unrouted)
  Top 0.381: 113,50.26 113,49.62 113.63,49.62
  Top 0.406: v135.4,39.8 v136.2,39.8 136.24,40.21 136.64,40.61 | U7.M2 U7.A2 | U7.A4 U7.M4 | U7.M5 U7.M7 | v133,50.2 U7.A8 U7.A9 | v133,50.2 U7.A10 U7.A9 | U7.A9 v133,50.2
  Top 0.5: U7.H6 U7.L6 v135.4,39.8 | U8.M2 U8.A2 | U8.M5 U8.M6 | U8.M6 U8.M7 | U8.M6 115.44,40.81 115.24,40.61 U8.M7 | U8.M6 v115.4,39.8 | U8.M6 U8.M4 v116.2,39.8 | v115.4,39.8 U8.M7 | v116.2,39.8 v115.4,39.8 | U8.M6 v116.2,39.8 | U6.A9 U6.A8 v133,30.2 | v133,30.2 133.04,29.81 133.04,29.41 U6.A10 v133,30.2 | U6.M6 U6.M5 U6.M4 v136.2,19.8 135.94,20.11 U6.M6 | U6.M6 U6.M7 v135.4,19.8 U6.M6 | U6.M2 U6.A2 | U5.A6 v115.4,19.8 | v115.4,19.8 v116.2,19.8 | v116.2,19.8 U5.M4 | U5.M4 U5.M5 | U5.M5 U5.M7 v115.4,19.8 | v115.4,19.8 U5.M5 | U5.M4 U5.A4 | U5.M2 U5.A2 | v113,30.2 U5.A9 | U5.A9 U5.A10 | U5.A10 U5.B10 | U5.A9 U5.A8 v113,30.2 | v113,30.2 U5.A10 | v116.2,19.8 U5.M5 | U5.M5 U5.M6 | U8.A9 U8.A10 v113,50.2 113.63,49.62 U8.A8 U8.A9
  other vias: 138.6,41.4 138.6,43.8 137,41.4 135.4,41.4 133.8,41.4 132.2,41.4 137,43.8 135.4,43.8 133.8,43.8 132.2,43.8 115.4,48.6 117,48.6 118.6,48.6 113.8,48.6 112.2,48.6 113.8,46.2 112.2,46.2 115.4,46.2 117,46.2 118.6,46.2 113.8,43.8 113.8,41.4 112.2,41.4 112.2,43.8 118.6,43.8 117,43.8 115.4,43.8 115.4,41.4 117,41.4 118.6,41.4 138.6,46.2 138.6,48.6 137,46.2 137,48.6 135.4,46.2 135.4,48.6 133.8,46.2 133.8,48.6 132.2,46.2 132.2,48.6 135.4,28.6 137,28.6 138.6,28.6 133.8,28.6 132.2,28.6 133.8,26.2 132.2,26.2 135.4,26.2 137,26.2 138.6,26.2 133.8,23.8 133.8,21.4 132.2,21.4 132.2,23.8 138.6,23.8 137,23.8 135.4,23.8 135.4,21.4 137,21.4 138.6,21.4 115.4,28.6 117,28.6 118.6,28.6 113.8,28.6 112.2,28.6 113.8,26.2 112.2,26.2 115.4,26.2 117,26.2 118.6,26.2 113.8,23.8 113.8,21.4 112.2,21.4 112.2,23.8 118.6,23.8 117,23.8 115.4,23.8 115.4,21.4 117,21.4 118.6,21.4
  pour $VCC: 91,99 159,99 159,1 91,1
  pour Bottom: 91,1 159,1 159,99 91,99
VDD-IO-3V3  (1 unrouted)
VIN1  (6 unrouted)
VIN2  (6 unrouted)
VIN-3.3V  (2 unrouted)
VIN-5.0V  (2 unrouted)

## Text on the board
tDocu: A3 | A4 | A5 | A2 | A1